# EAGLE design Xbee_node (EAGLE 5.06)
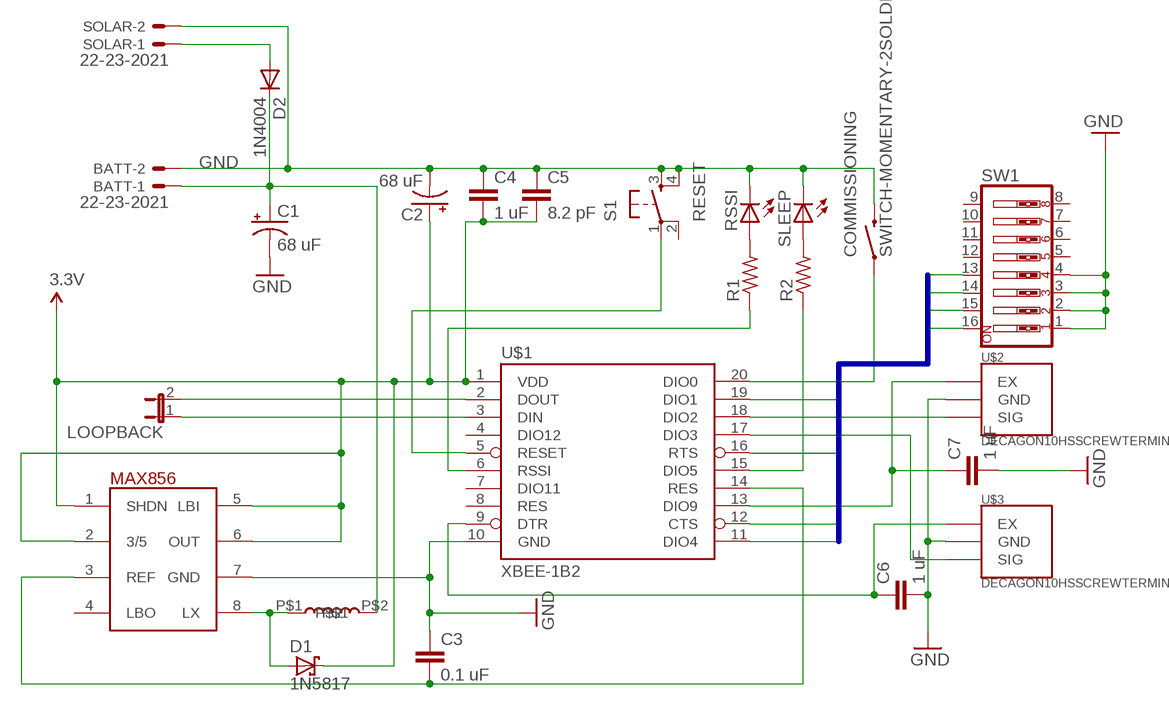
[diagram p0: schematic, sheet 1]

## Parts
BATT  22-23-2021  [22-23-2021]
C1  68 uF  CAP_POLPTH2  [CPOL-RADIAL-10UF-25V]
C2  68 uF  CAP_POLPTH2  [CPOL-RADIAL-10UF-25V]
C3  0.1 uF  CAPPTH2  [CAP-PTH-SMALL2]
C4  1 uF  CAPPTH2  [CAP-PTH-SMALL2]
C5  8.2 pF  CAPPTH2  [CAP-PTH-SMALL2]
C6  1 uF  CAPPTH2  [CAP-PTH-SMALL2]
C7  1 uF  CAPPTH2  [CAP-PTH-SMALL2]
COMMISSIONING  SWITCH-MOMENTARY-2SOLDER  [1X02]
D1  1N5817  SCHOTTKY-DIODEDO35-7  [DO35-7]
D2  1N4004  [DO41-10]
LOOPBACK  JP1E  [JP1]
MAX856  MAX856  [SO08]
R1  R-US_0411/12  [0411/12]
R2  R-US_0411/12  [0411/12]
RSSI  LED3MM  [LED3MM]
S1  RESET  TAC_SWITCHPTH  [TACTILE-PTH]
SLEEP  LED3MM  [LED3MM]
SOLAR  22-23-2021  [22-23-2021]
SW1  SW_DIP-8  [DIPSWITCH-08]
U$1  XBEE-1B2  [XBEE-SILK]
U$2  DECAGON10HSSCREWTERMINAL  [SCREWTERMINAL-5MM-3]
U$3  DECAGON10HSSCREWTERMINAL  [SCREWTERMINAL-5MM-3]
U$4  47uH  MURATA_RADIAL_IND  [MURATA_IND]

## Nets
3.3V: C2.1(+) C4.2 C5.2 D1.C MAX856.1(SHDN) MAX856.2(3/5) MAX856.5(LBI) MAX856.6(OUT) U$1.1(VDD)
BATT: BATT.1 C1.1(+) D2.C U$4.P$2
CTS: SW1.14 U$1.12(CTS)
DIO1: SW1.16 U$1.19(DIO1)
DIO4: SW1.15 U$1.11(DIO4)
GND: BATT.2 C1.2(-) C2.2(-) C3.1 C4.1 C5.1 C6.2 C7.2 COMMISSIONING.2 MAX856.7(GND) RSSI.K(C) S1.3 S1.4 SLEEP.K(C) SOLAR.2 SW1.1 SW1.2 SW1.3 SW1.4 U$1.10(GND) U$2.GND U$3.GND
LOOPBACK: LOOPBACK.2 U$1.2(DOUT)
N$1: U$1.18(DIO2) U$2.SIG
N$2: C7.1 U$1.13(DIO9) U$2.EX
N$3: C6.1 U$1.9(DTR) U$3.EX
N$4: U$1.17(DIO3) U$3.SIG
N$5: D2.A SOLAR.1
N$6: D1.A MAX856.8(LX) U$4.P$1
N$9: C3.2 MAX856.3(REF) U$1.14(RES)
N$11: COMMISSIONING.1 U$1.20(DIO0)
N$12: R1.2 RSSI.A
N$13: R2.1 U$1.15(DIO5)
N$14: R2.2 SLEEP.A
N$15: R1.1 U$1.6(RSSI)
N$16: LOOPBACK.1 U$1.3(DIN)
N$18: S1.1 U$1.5(RESET)
RTS: SW1.13 U$1.16(RTS)
Unconnected: MAX856.4(LBO) S1.2 SW1.5 SW1.6 SW1.7 SW1.8 SW1.9 SW1.10 SW1.11 SW1.12 U$1.4(DIO12) U$1.7(DIO11) U$1.8(RES)

## Buses
DIO4,CTS,RTS,DIO1

## Library data of the parts
BATT SOLAR = con-molex:22-23-2021: .100" (2.54mm) Center Header - 2 Pin
C1 C2 = SparkFun:CAP_POL: Capacitor Polarized These are standard SMD and PTH capacitors. Normally 10uF, 47uF, and 100uF in electrolytic and tantalum varieties. Always verify the external diameter of the through hole cap, it varies with capacity, voltage, and manufacturer. The EIA devices should be standard.
C3-C7 = SparkFun:CAP: Capacitor Standard 0603 ceramic capacitor, and 0.1" leaded capacitor.
COMMISSIONING = jeff2:SWITCH-MOMENTARY-2
D1 = diode:SCHOTTKY-DIODE: Schottky Diode
D2 = diode:1N4004: DIODE general purpose rectifier, 1 A
LOOPBACK = jumper:JP1E: JUMPER
MAX856 = SparkFun:MAX856
R1 R2 = resistor:R-US_: RESISTOR, American symbol
RSSI SLEEP = led:LED: LED OSRAM: - CHIPLED LG R971, LG N971, LY N971, LG Q971, LY Q971, LO R971, LY R971 LH N974, LH R974 LS Q976, LO Q976, LY Q976 LO Q996 - Hyper CHIPLED LW Q18S LB Q993, LB Q99A, LB R99A - SideLED LS A670, LO A670, LY A670, LG A670, LP A670 LB A673, LV A673, LT A673, LW A673 LH A674 LY A675 LS A676, LA A676, LO A676, LY A676, LW A676 LS A679, LY A679, LG A679 - Hyper Micro SIDELED® LS Y876, LA Y876, LO Y876, LY Y876 LT Y87S - SmartLED LW L88C, LW L88S LB L89C, LB L89S, LG L890 LS L89K, LO L89K, LY L89K LS L896, LA L896, LO L896, LY L896 - TOPLED LS T670, LO T670, LY T670, LG T670, LP T670 LSG T670, LSP T670, LSY T670, LOP T670, LYG T670 LG T671, LOG T671, LSG T671 LB T673, LV T673, LT T673, LW T673 LH T674 LS T676, LA T676, LO T676, LY T676, LB T676, LH T676, LSB T676, LW T676 LB T67C, LV T67C, LT T67C, LS T67K, LO T67K, LY T67K, LW E67C LS E67B, LA E67B, LO E67B, LY E67B, LB E67C, LV E67C, LT E67C LW T67C LS T679, LY T679, LG T679 LS T770, LO T770, LY T770, LG T770, LP T770 LB T773, LV T773, LT T773, LW T773 LH T774 LS E675, LA E675, LY E675, LS T675 LS T776, LA T776, LO T776, LY T776, LB T776 LHGB T686 LT T68C, LB T68C - Hyper Mini TOPLED® LB M676 - Mini TOPLED Santana® LG M470 LS M47K, LO M47K, LY M47K Source: http://www.osram.convergy.de LUXEON: - LUMILED® LXK2-PW12-R00, LXK2-PW12-S00, LXK2-PW14-U00, LXK2-PW14-V00 LXK2-PM12-R00, LXK2-PM12-S00, LXK2-PM14-U00 LXK2-PE12-Q00, LXK2-PE12-R00, LXK2-PE12-S00, LXK2-PE14-T00, LXK2-PE14-U00 LXK2-PB12-K00, LXK2-PB12-L00, LXK2-PB12-M00, LXK2-PB14-N00, LXK2-PB14-P00, LXK2-PB14-Q00 LXK2-PR12-L00, LXK2-PR12-M00, LXK2-PR14-Q00, LXK2-PR14-R00 LXK2-PD12-Q00, LXK2-PD12-R00, LXK2-PD12-S00 LXK2-PH12-R00, LXK2-PH12-S00 LXK2-PL12-P00, LXK2-PL12-Q00, LXK2-PL12-R00 Source: www.luxeon.com KINGBRIGHT: KA-3528ASYC Source: www.kingbright.com
S1 = SparkFun:TAC_SWITCH: Momentary Switch Button commonly used for reset or general input. Spark Fun Electronics SKU : COM-00097
SW1 = SparkFun:SW_DIP-8: DIP Switch 8 Position Spark Fun Electronics SKU : COM-08034
U$1 = SparkFun:XBEE-1
U$2 U$3 = jeff2:DECAGON10HS
U$4 = jeff2:MURATA_RADIAL_IND

## Board
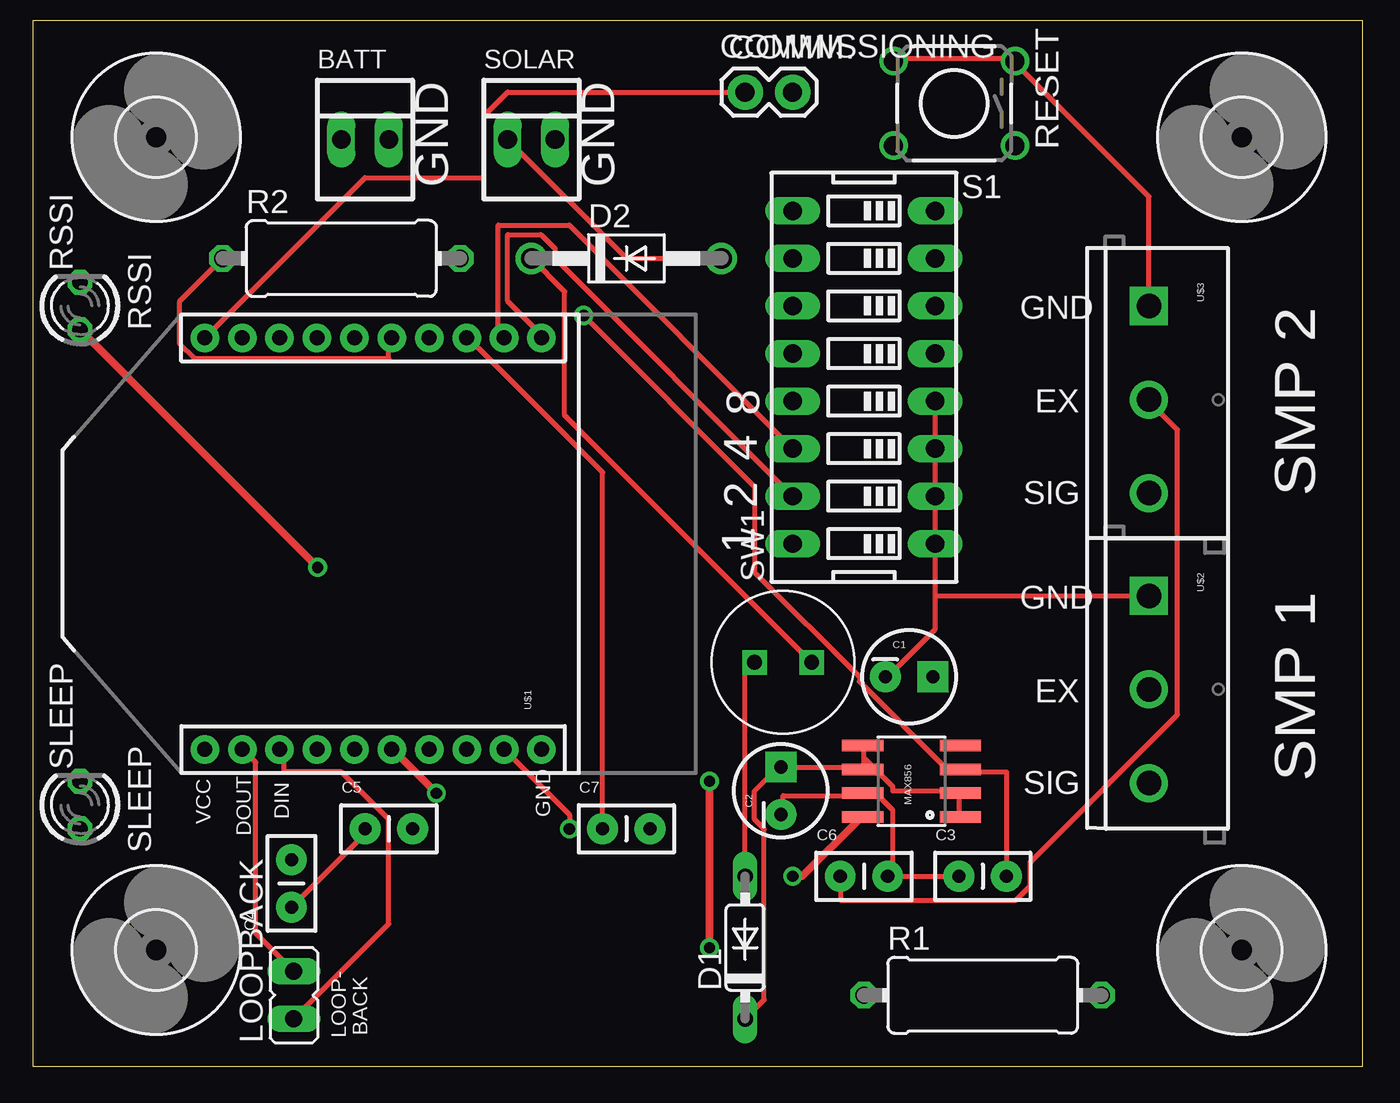
[diagram p1: board, top side]
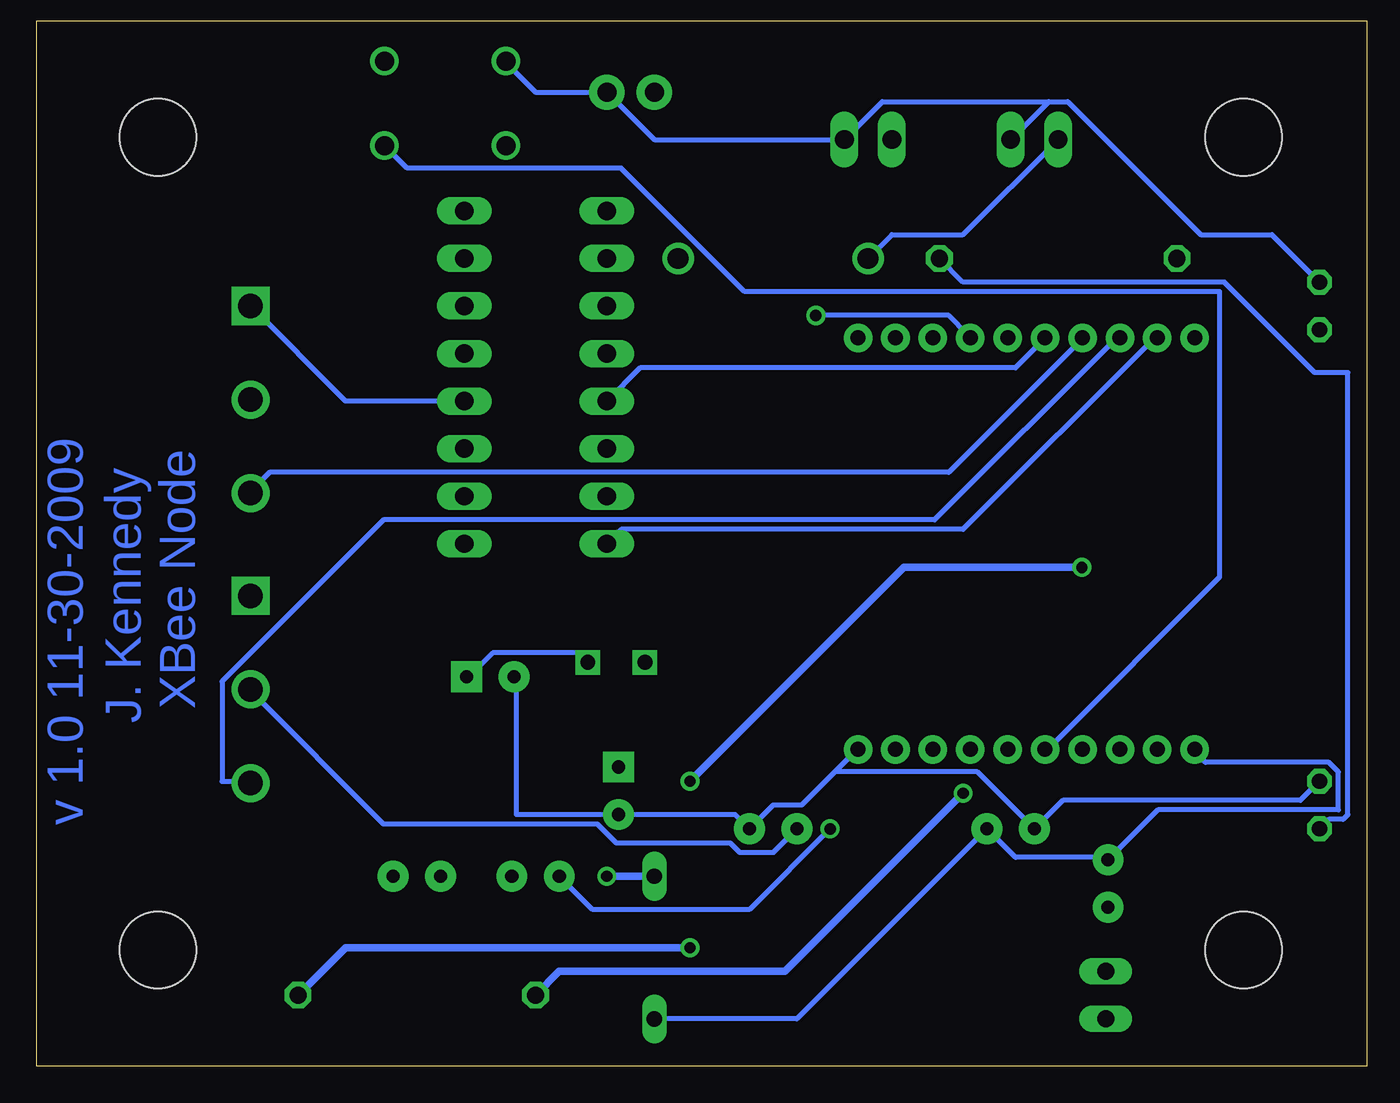
[diagram p2: board, bottom side, seen from below]

No outline drawn. Coordinates in mm, seen from the top.
Copper layers (1*16): Top 0.035mm / dielectric 1.5mm / Bottom 0.035mm
Design rules "default": minimum track width 10mil, minimum drill 24mil, track to track 8mil, track to pad 8mil, pad to pad 8mil, via to via 8mil, smd to smd 8mil, copper to edge 40mil, drill to drill 8mil, minimum pad ring 10mil, minimum via ring 8mil, stop-mask expansion 4mil, vias tented up to drill 0mil, thermal gap 10mil
tRestrict: area 24.1,-1.3 to 34.3,10.2
Milling: 4 lines

### Footprints (pad centres in the part's own frame; a part is rotated, then mirrored left to right if it is on the bottom)
22-23-2021 = drill 1 long: 1 -1.27,0; 2 1.27,0
CPOL-RADIAL-10UF-25V = drill 0.7 pad 1.651 square: 1 1.27,0 | drill 0.7 pad 1.651 round: 2 -1.27,0
CAP-PTH-SMALL2 = drill 0.7 pad 1.651 round: 1 0,0; 2 2.54,0
1X02 = drill 1.016 pad 1.88 round: 1 0,0; 2 2.54,0
DO35-7 = drill 0.813 long: A 3.81,0; C -3.81,0
DO41-10 = drill 1.118 round: A 5.08,0; C -5.08,0
JP1 = drill 0.914 long: 1 0,-1.27; 2 0,1.27
SO08 = smd 0.61 x 2.21: 1 -1.905,-2.616; 2 -0.635,-2.616; 3 0.635,-2.616; 4 1.905,-2.616; 5 1.905,2.616; 6 0.635,2.616; 7 -0.635,2.616; 8 -1.905,2.616
0411/12 = drill 0.914 octagon: 1 -6.35,0; 2 6.35,0
LED3MM = drill 0.813 octagon: A -1.27,0; K 1.27,0
TACTILE-PTH = drill 1.016 round: 1 -3.251,2.261; 2 3.251,2.261; 3 -3.251,-2.261; 4 3.251,-2.261
DIPSWITCH-08 = drill 0.97 long: 1 -8.89,-3.81; 2 -6.35,-3.81; 3 -3.81,-3.81; 4 -1.27,-3.81; 5 1.27,-3.81; 6 3.81,-3.81; 7 6.35,-3.81; 8 8.89,-3.81; 9 8.89,3.81; 10 6.35,3.81; 11 3.81,3.81; 12 1.27,3.81; 13 -1.27,3.81; 14 -3.81,3.81; 15 -6.35,3.81; 16 -8.89,3.81
XBEE-SILK = drill 0.8 pad 1.524 round: 1 -11,20; 2 -11,18; 3 -11,16; 4 -11,14; 5 -11,12; 6 -11,10; 7 -11,8; 8 -11,6; 9 -11,4; 10 -11,2; 11 11,2; 12 11,4; 13 11,6; 14 11,8; 15 11,10; 16 11,12; 17 11,14; 18 11,16; 19 11,18; 20 11,20
SCREWTERMINAL-5MM-3 = drill 1.3 pad 2.032 round: EX 5,0; SIG 10,0 | drill 1.3 pad 2.032 square: GND 0,0
MURATA_IND = drill 0.8 square: P$1 -1.524,0; P$2 1.524,0
4,1 = hole 4.1: 0,0

### Placement (x,y rotation side)
BATT  17.78,49.53 0 top
C1  46.86,20.83 0 top
C2  40.01,14.73 90 top
C3  49.53,10.16 0 top
C4  13.84,8.51 90 top
C5  17.78,12.7 0 top
C6  43.18,10.16 0 top
C7  30.48,12.7 0 top
COMMISSIONING  38.1,52.07 0 top
D1  38.1,6.35 90 top
D2  31.75,43.18 0 top
LOOPBACK  13.97,3.81 0 top
MAX856  46.99,15.24 90 top
R1  50.8,3.81 0 top
R2  16.51,43.18 0 top
RSSI  2.54,40.64 90 top
S1  49.28,51.47 180 top
SLEEP  2.54,13.97 90 top
SOLAR  26.67,49.53 0 top
SW1  44.45,36.83 90 top
U$1  29.21,27.94 90 top
U$2  59.69,25.15 270 top
U$3  59.69,40.64 270 top
U$4  40.13,21.59 0 top
U$5  [4,1]  6.6,6.22 0 top
U$6  [4,1]  6.6,49.66 0 top
U$7  [4,1]  64.64,6.22 0 top
U$8  [4,1]  64.64,49.66 0 top

### Tracks (layer width: path | path; a pad name or v marks a point on that pad's centre or on a via)
3.3V
  Top 0.254: MAX856.1 49.53,13.46 49.53,14.48 MAX856.2 49.53,14.73 45.97,14.73 45.97,14.99 44.45,16.51 | 44.45,16.51 44.45,17.02 MAX856.5 | 44.45,16.51 44.45,16 MAX856.6 44.2,16 C2.1 39.88,16 38.61,14.73 38.61,13.21 39.12,12.7 39.12,3.56 D1.C
  Bottom 0.254: U$1.1 9.14,16.76 8.64,16.26 2.03,16.26 1.52,15.75 1.52,13.72 11.18,13.72 C4.2 13.97,11.18 18.8,11.18 C5.2 30.48,2.54 D1.C
BATT
  Top 0.254: U$4.P$2 28.45,34.8 28.45,41.4 D2.C
  Bottom 0.254: U$4.P$2 42.16,22.1 46.74,22.1 48.01,20.83 C1.1 | BATT.1 21.59,44.45 25.4,44.45 D2.C
CTS
  Top 0.254: SW1.14 28.7,44.96 24.89,44.96 24.89,39.37 25.15,39.12 U$1.12
DIO1
  Bottom 0.254: SW1.16 39.88,28.7 21.59,28.7 11.43,38.86 U$1.19
DIO4
  Top 0.254: SW1.15 27.94,43.18 27.94,43.69 27.18,44.45 25.4,44.45 25.4,40.89 27.18,39.12 U$1.11
GND
  Top 0.254: S1.4 46.23,53.85 52.32,53.85 S1.3 52.58,53.59 59.69,46.48 U$3.GND | SW1.4 SW1.3 SW1.2 SW1.1 48.26,25.15 | 48.26,25.15 48.26,23.37 45.72,20.83 C1.2 | 48.26,25.15 U$2.GND | C5.1 17.78,12.45 C4.1 | 45.97,10.16 C3.1 | C2.2 40.13,13.46 40.13,14.48 44.2,14.48 MAX856.7 44.45,14.48 45.21,14.48 45.97,13.72 45.97,10.16 | 45.97,10.16 C6.2
  Bottom 0.254: S1.4 45.97,53.59 44.45,52.07 COMMISSIONING.2 38.1,49.53 SOLAR.2 25.91,51.56 17.02,51.56 | RSSI.K 5.08,44.45 8.89,44.45 16,51.56 17.02,51.56 | 17.02,51.56 BATT.2 | U$3.GND 54.61,35.56 SW1.4 | SLEEP.K 3.56,14.22 16.26,14.22 C5.1 20.83,15.75 28.45,15.75 | 28.45,15.75 30.23,13.97 31.75,13.97 C7.2 33.78,13.46 C2.2 45.47,13.46 45.47,20.83 C1.2 | 28.45,15.75 27.43,16.76 U$1.10
LOOPBACK
  Top 0.254: LOOPBACK.2 11.94,7.11 11.94,16.26 11.43,16.76 U$1.2
N$1
  Bottom 0.254: U$1.18 13.46,38.86 23.11,29.21 52.58,29.21 61.21,20.57 61.21,15.24 59.69,15.24 U$2.SIG
N$2
  Top 0.254: C7.1 30.48,31.75 23.37,38.86 U$1.13
  Bottom 0.254: C7.1 31.75,11.43 33.53,11.43 34.04,11.94 40.13,11.94 41.15,12.95 52.58,12.95 59.69,20.07 U$2.EX
N$3  (via drill 0.61)
  Top 0.254: v28.7,12.7 28.7,13.46 25.4,16.76 U$1.9 | C6.1 43.18,8.89 52.58,8.89 53.34,9.65 53.34,10.92 61.21,18.8 61.21,34.04 59.69,35.56 U$3.EX
  Bottom 0.254: v28.7,12.7 33.02,8.38 41.4,8.38 C6.1
N$4
  Bottom 0.254: U$1.17 15.24,38.86 22.35,31.75 58.67,31.75 59.69,30.73 U$3.SIG
N$5
  Top 0.254: SOLAR.1 31.75,43.18 D2.A
N$6  (via drill 0.6)
  Top 0.254: MAX856.8 44.2,13.21 | U$4.P$1 38.1,21.08 D1.A
  Top 0.406: 44.2,13.21 41.15,10.16 v40.64,10.16
  Bottom 0.406: v40.64,10.16 D1.A
N$9  (via drill 0.61)
  Top 0.254: C3.2 52.07,15.75 49.78,15.75 MAX856.3 49.53,16 48.77,16 44.2,20.57 44.2,20.83 38.61,26.42 38.61,30.99 v29.46,40.13
  Bottom 0.254: v29.46,40.13 22.35,40.13 21.34,39.12 U$1.14
N$11
  Top 0.254: COMMISSIONING.1 25.4,52.07 24.13,50.8 24.13,47.5 17.78,47.5 9.4,39.12 U$1.20
N$12  (via drill 0.6)
  Top 0.406: v36.2,6.35 v36.2,15.24 | v15.24,26.67 RSSI.A
  Bottom 0.406: R1.2 54.61,6.35 v36.2,6.35 | v36.2,15.24 24.77,26.67 v15.24,26.67
N$13
  Top 0.254: R2.1 7.87,40.89 7.87,38.61 8.64,37.85 19.05,37.85 19.05,38.86 U$1.15
N$14
  Bottom 0.254: SLEEP.A 2.03,13.21 1.27,13.21 1.02,13.46 1.02,37.08 2.79,37.08 7.62,41.91 21.59,41.91 R2.2
N$15  (via drill 0.6)
  Top 0.254: U$1.6 19.3,16.76
  Top 0.406: v21.59,14.61 19.25,16.94 U$1.6
  Bottom 0.406: R1.1 43.18,5.08 31.11,5.08 v21.59,14.61
N$16
  Top 0.254: LOOPBACK.1 19.05,7.62 19.05,13.21 16.51,15.75 13.46,15.75 13.46,16.76 U$1.3
N$18
  Bottom 0.254: U$1.5 17.02,17.02 7.87,26.16 7.87,41.4 33.27,41.4 39.88,48.01 51.31,48.01 52.32,49.02 S1.1
RTS
  Bottom 0.254: SW1.13 38.86,37.34 18.8,37.34 17.27,38.86 U$1.16

### Text on the board
Bottom: XBee Node | J. Kennedy | v 1.0 11-30-2009
tPlace: COMM. | RESET | GND | GND | RSSI | 8 | 4 | 2 | SMP 2 | 1 | SMP 1 | VCC | DIN | GND | DOUT | SLEEP | LOOP- | BACK